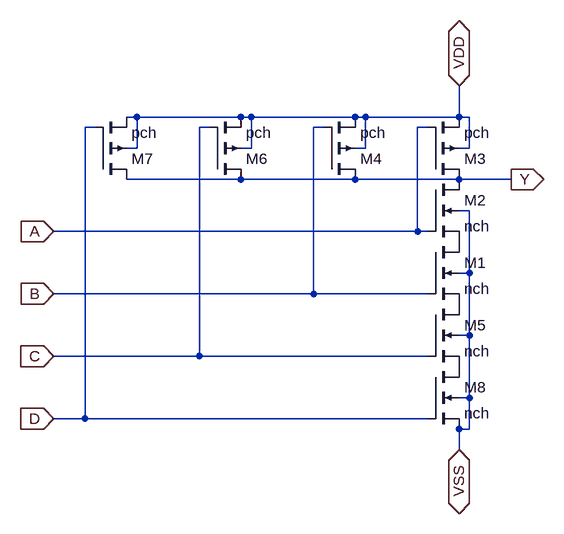
[diagram p0: schematic nand4.asc]
nand4.asc, the LTspice schematic file:
Version 4
SHEET 1 880 680
WIRE -256 -32 -272 -32
WIRE -96 -32 -256 -32
WIRE -80 -32 -96 -32
WIRE 80 -32 -80 -32
WIRE 96 -32 80 -32
WIRE 240 -32 240 -80
WIRE 240 -32 96 -32
WIRE 256 -32 240 -32
WIRE -320 -16 -336 -16
WIRE -144 -16 -160 -16
WIRE 32 -16 16 -16
WIRE 192 -16 176 -16
WIRE -256 16 -256 -32
WIRE -256 16 -272 16
WIRE -80 16 -80 -32
WIRE -80 16 -96 16
WIRE 96 16 96 -32
WIRE 96 16 80 16
WIRE 256 16 256 -32
WIRE 256 16 240 16
WIRE -96 64 -272 64
WIRE 80 64 -96 64
WIRE 240 64 80 64
WIRE 320 64 240 64
WIRE 256 112 240 112
WIRE 176 144 176 -16
WIRE 176 144 -384 144
WIRE 192 144 176 144
WIRE 256 208 256 112
WIRE 256 208 240 208
WIRE 16 240 16 -16
WIRE 16 240 -384 240
WIRE 192 240 16 240
WIRE 256 304 256 208
WIRE 256 304 240 304
WIRE -160 336 -160 -16
WIRE -160 336 -384 336
WIRE 192 336 -160 336
WIRE 256 400 256 304
WIRE 256 400 240 400
WIRE -336 432 -336 -16
WIRE -336 432 -384 432
WIRE 192 432 -336 432
WIRE 256 448 256 400
WIRE 256 448 240 448
WIRE 240 480 240 448
FLAG -384 144 A
IOPIN -384 144 In
FLAG -384 240 B
IOPIN -384 240 In
FLAG 320 64 Y
IOPIN 320 64 Out
FLAG -384 336 C
IOPIN -384 336 In
FLAG -384 432 D
IOPIN -384 432 In
FLAG 240 480 VSS
IOPIN 240 480 BiDir
FLAG 240 -80 VDD
IOPIN 240 -80 BiDir
SYMBOL nmos4 192 160 R0
SYMATTR InstName M1
SYMATTR Value nch
SYMATTR Value2 l=ln w=wn
SYMBOL nmos4 192 64 R0
SYMATTR InstName M2
SYMATTR Value nch
SYMATTR Value2 l=ln w=wn
SYMBOL pmos4 192 64 M180
SYMATTR InstName M3
SYMATTR Value pch
SYMATTR Value2 l=lp w=wp
SYMBOL pmos4 32 64 M180
SYMATTR InstName M4
SYMATTR Value pch
SYMATTR Value2 l=lp w=wp
SYMBOL nmos4 192 256 R0
SYMATTR InstName M5
SYMATTR Value nch
SYMATTR Value2 l=ln w=wn
SYMBOL pmos4 -144 64 M180
SYMATTR InstName M6
SYMATTR Value pch
SYMATTR Value2 l=lp w=wp
SYMBOL nmos4 192 352 R0
SYMATTR InstName M8
SYMATTR Value nch
SYMATTR Value2 l=ln w=wn
SYMBOL pmos4 -320 64 M180
SYMATTR InstName M7
SYMATTR Value pch
SYMATTR Value2 l=lp w=wp

The netlist it stands for:
* nand4.asc
M1 P001 B P002 VSS nch l=ln w=wn
M2 Y A P001 VSS nch l=ln w=wn
M3 Y A VDD VDD pch l=lp w=wp
M4 Y B VDD VDD pch l=lp w=wp
M5 P002 C P003 VSS nch l=ln w=wn
M6 Y C VDD VDD pch l=lp w=wp
M8 P003 D VSS VSS nch l=ln w=wn
M7 Y D VDD VDD pch l=lp w=wp
.model NMOS NMOS
.model PMOS PMOS
.lib standard.mos
.backanno
.end